# EasyEDA schematic SCH_Pet-Tracker-project_2025-07-16.json
TITLE: Pet tracker prototype; REV: 1.0; Date: 2025-07-04; Sheet: 1/1; Drawn By: Ebrahim Abdelghfar; Company: FreeLance
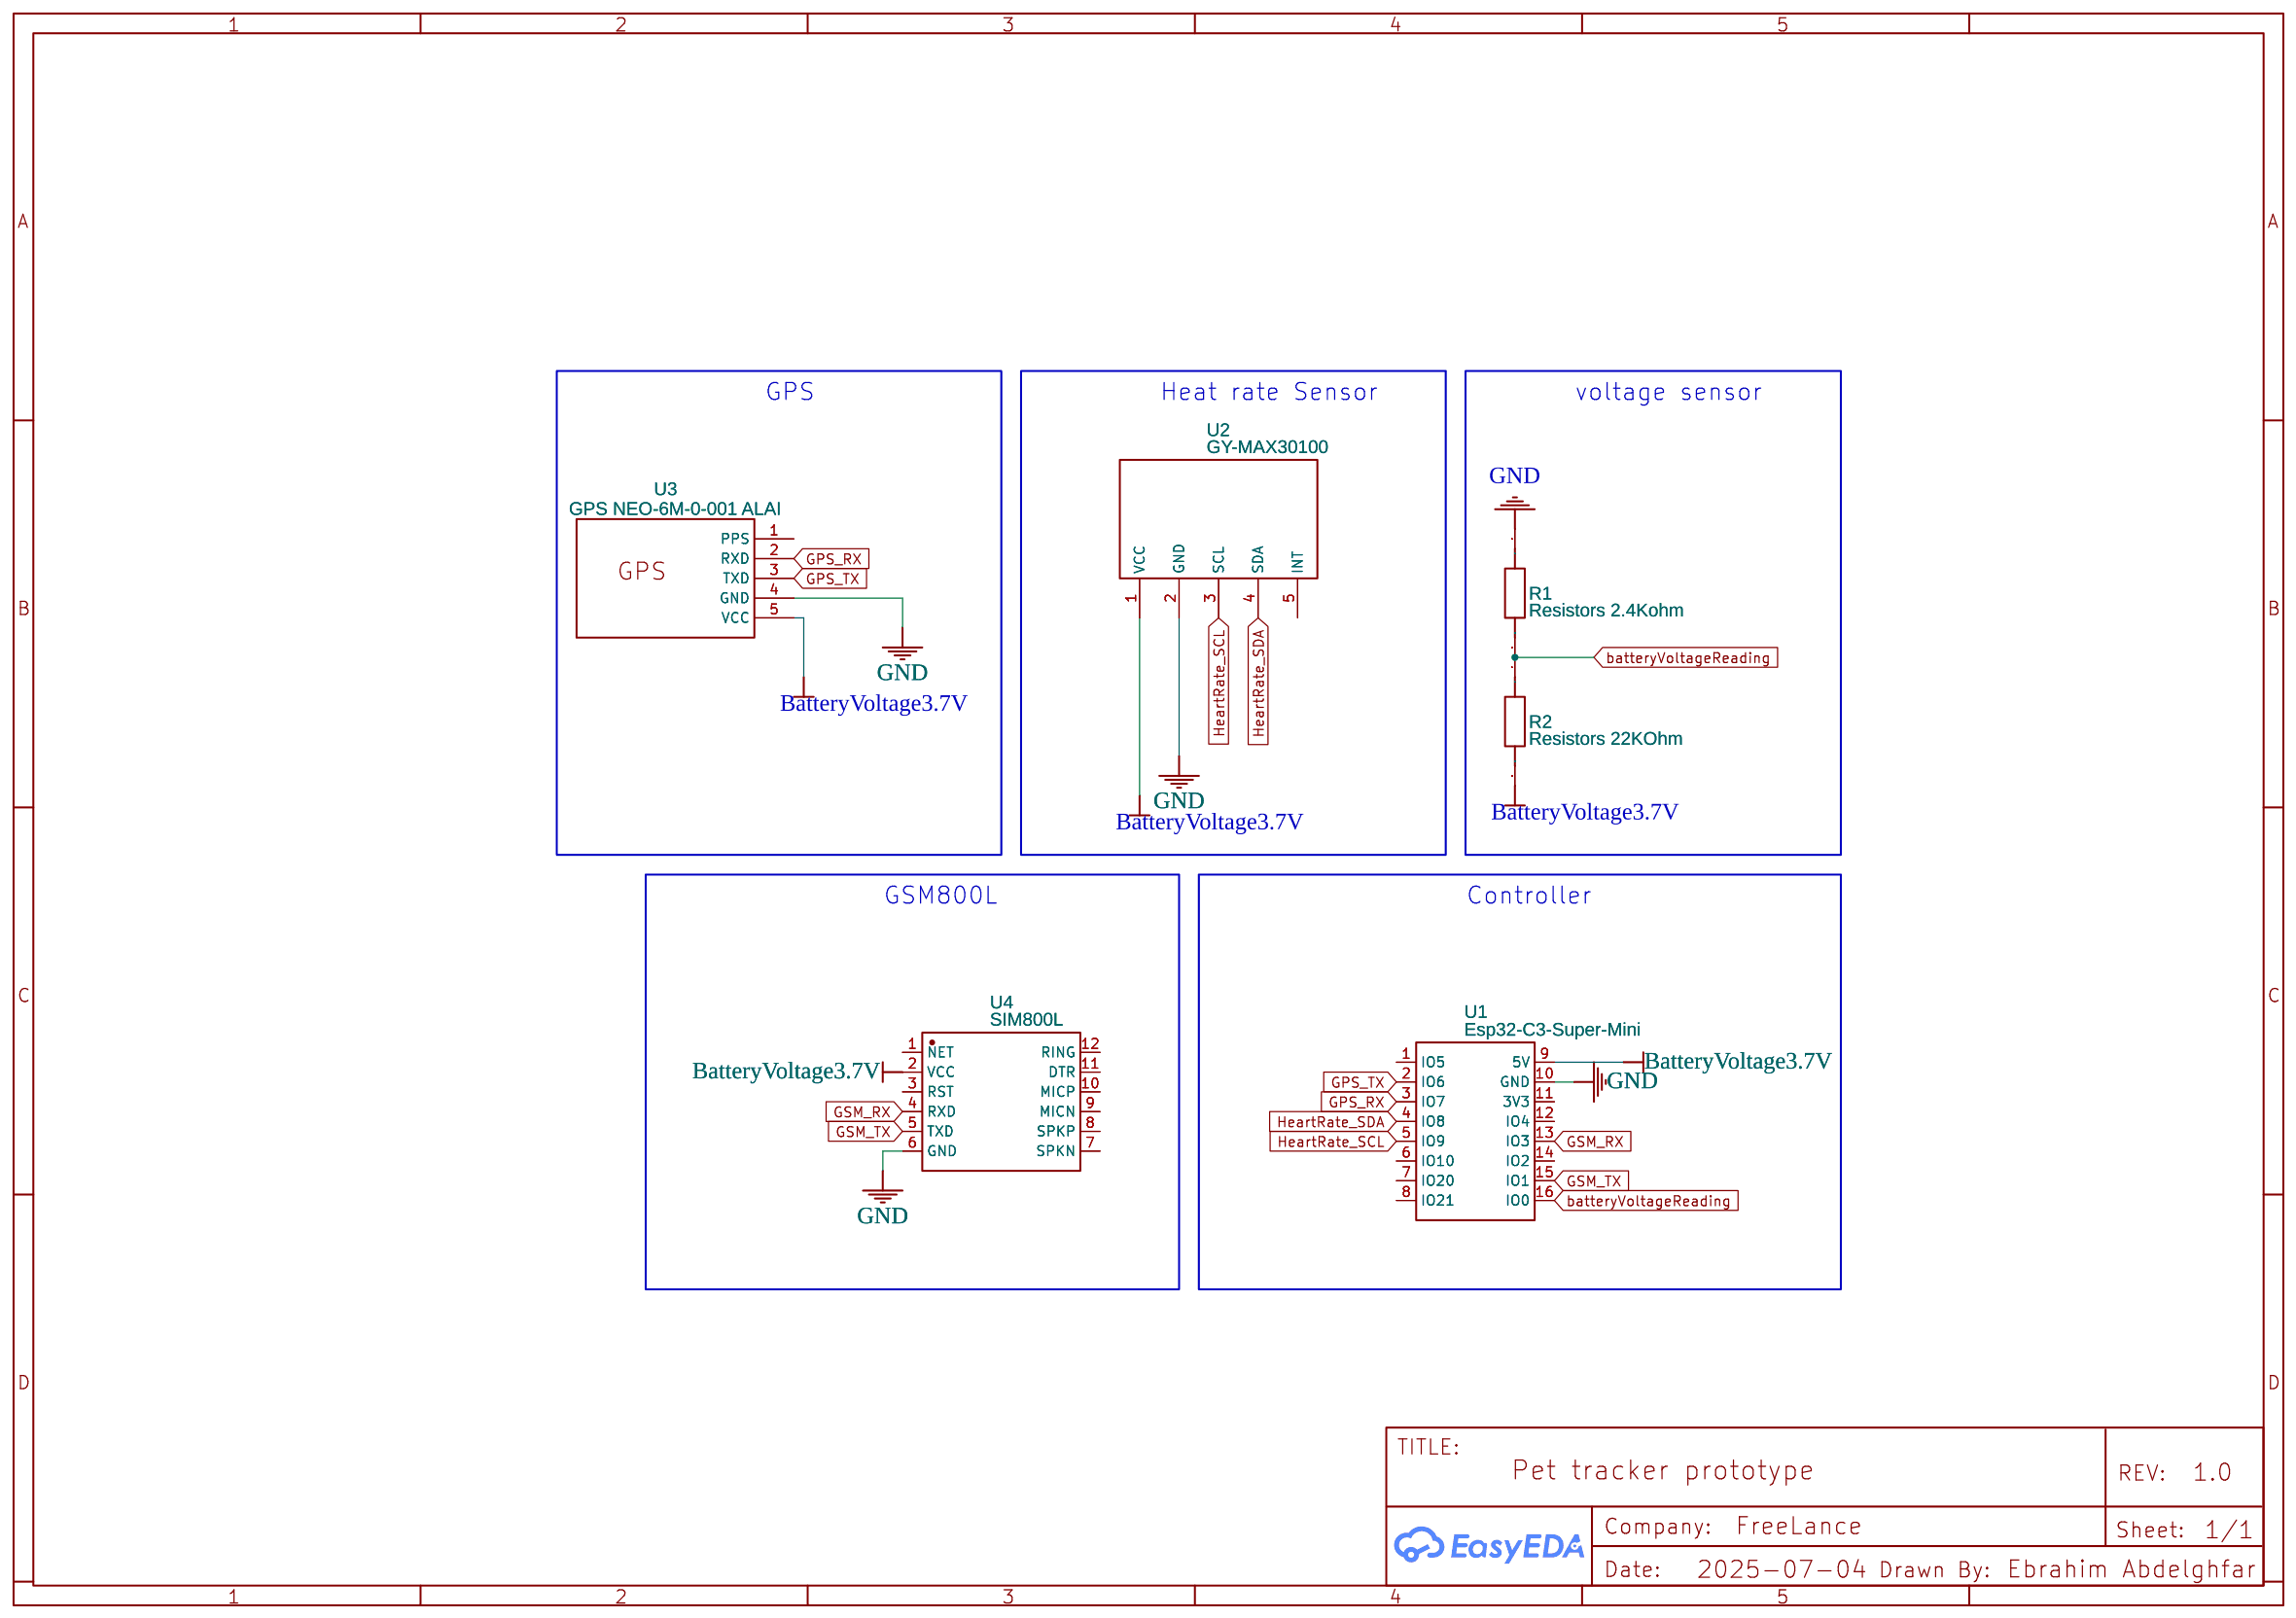
[diagram p0: schematic sheet]

## Parts
R1  Resistors 2.4Kohm  [RESISTORS - AXIAL-0.25WATT]
R2  Resistors 22KOhm  [RESISTORS - AXIAL-0.25WATT]
U1  Esp32-C3-Super-Mini  [ESP32-C3-SUPER-MINI]
U2  GY-MAX30100  [GY_MAX30100]
U3  GPS NEO-6M-0-001 ALAI  [GPS NEO-6M-0-001 ALAI]
U4  SIM800L  [SIM800L]

## Library data of the parts
R1 R2 = Resistors C4-1: Contributor: medovdenis
U1 = Esp32-C3-Super-Mini: Contributor: jousterde1
U2 = GY-MAX30100: Contributor: u2009020
U3 = GPS NEO-6M-0-001 ALAI: Contributor: angeloprato
U4 = SIM800L: Contributor: ahmed.alsikely773

## Nets
GND: R1.1 U1.10(GND) U2.2(GND) U3.4(GND) U4.6(GND)
BatteryVoltage3.7V: R2.2 U1.9(5V) U2.1(VCC) U3.5(VCC) U4.2(VCC)
batteryVoltageReading: R1.2 R2.1 U1.16(IO0)
GPS_RX: U1.3(IO7) U3.2(RXD)
GPS_TX: U1.2(IO6) U3.3(TXD)
GSM_RX: U1.13(IO3) U4.4(RXD)
GSM_TX: U1.15(IO1) U4.5(TXD)
HeartRate_SCL: U1.5(IO9) U2.3(SCL)
HeartRate_SDA: U1.4(IO8) U2.4(SDA)

Not connected (* = marked no-connect by the designer): U1 1(IO5) 6(IO10) 7(IO20) 8(IO21) 11(3V3) 12(IO4) 14(IO2); U2 5(INT); U3 1(PPS); U4 1(NET) 3(RST) 7(SPKN) 8(SPKP) 9(MICN) 10(MICP) 11(DTR) 12(RING)

## Notes on the sheet
- GPS
- Heat rate Sensor
- voltage sensor
- GSM800L
- Controller
